# EasyEDA Pro project 51单片机串口开关V3.eprj

# Schematic Schematic1
Create Date: 2023-08-01; Page Name: P1; Project Name: 51单片机串口开关V3; Schematic Name: Schematic1; Update Date: 2023-11-15; Company: 嘉立创EDA; Page Size: A4; Version: V1.0
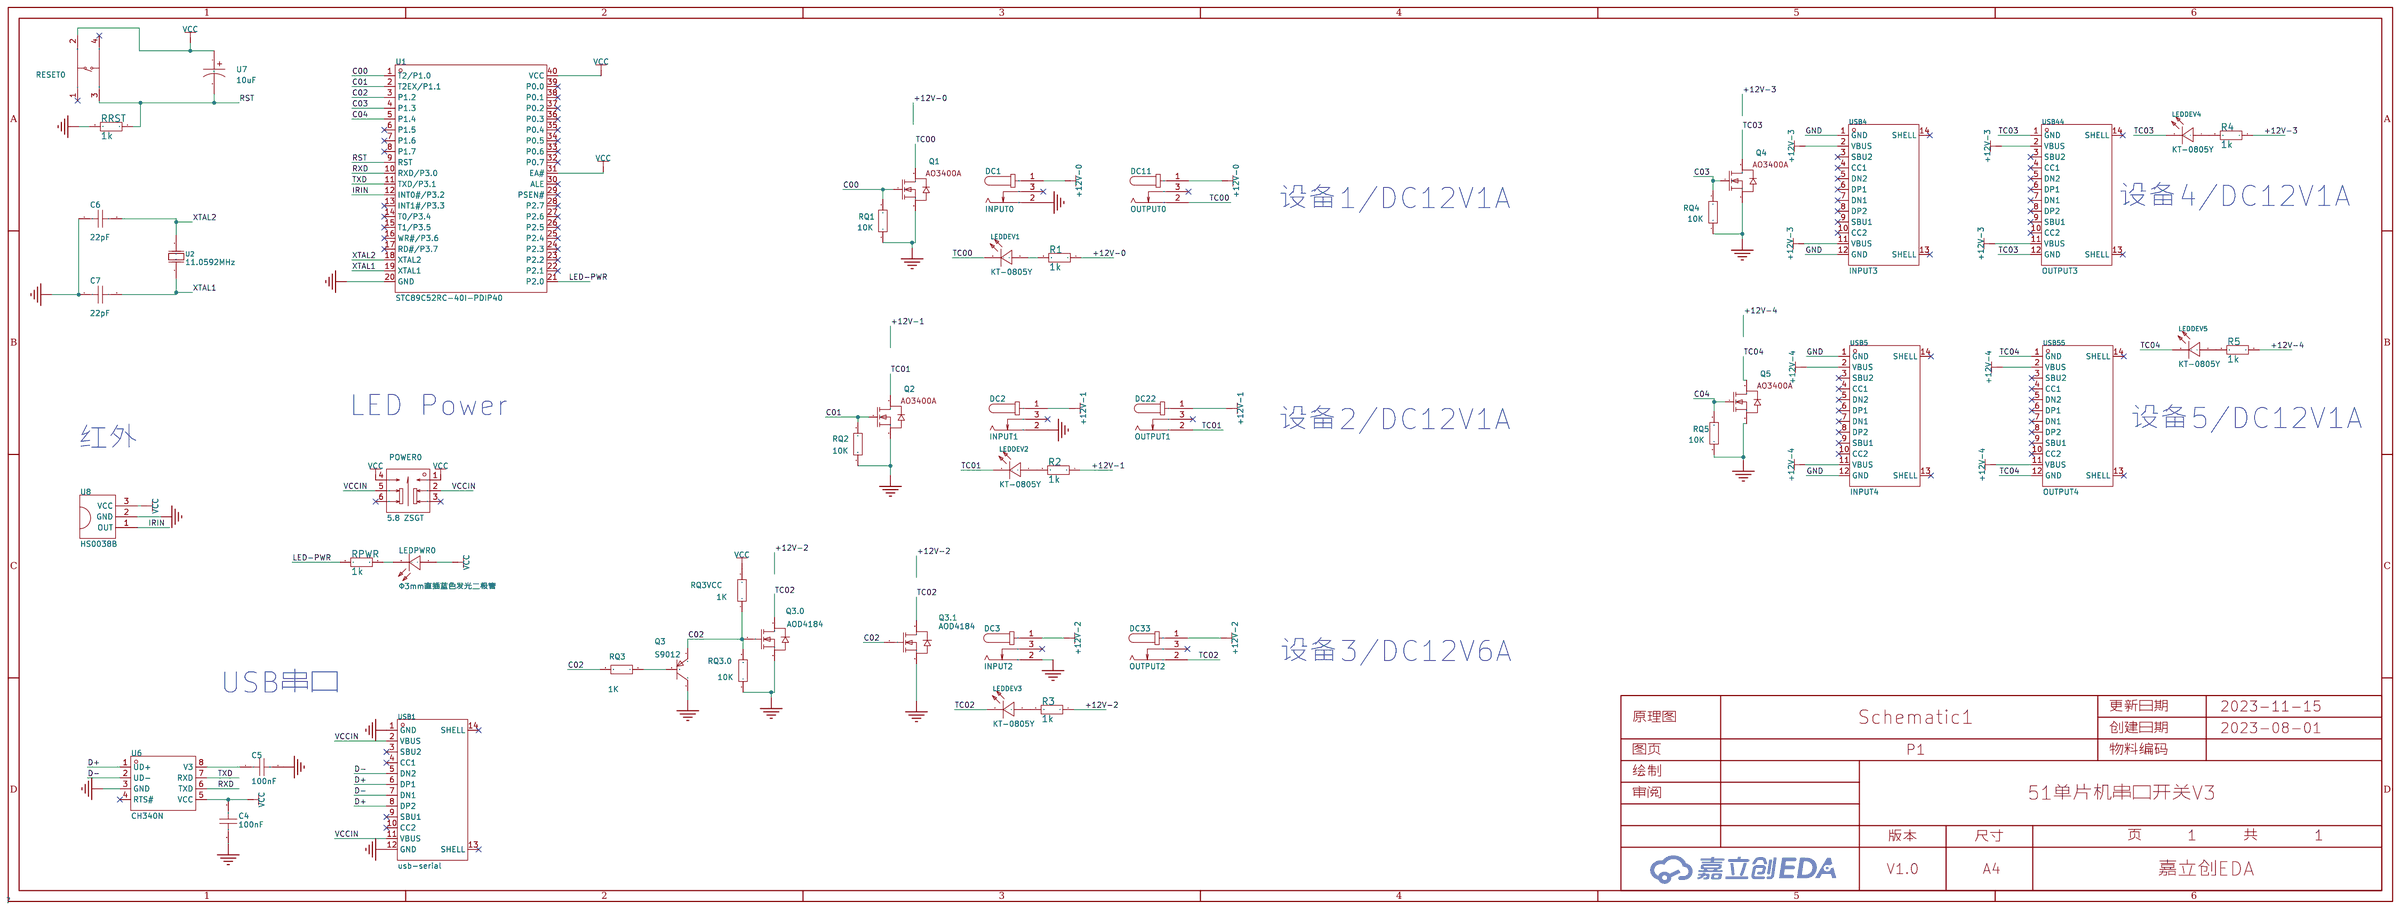
[diagram p0: schematic sheet]

## Parts
C4  100nF  [C0603]
C5  100nF  [C0603]
C6  22pF  [CAP-TH_L5.8-W2.4-P2.54-D0.6]
C7  22pF  [CAP-TH_L5.8-W2.4-P2.54-D0.6]
DC1  INPUT0  [DC-IN-TH_DC-005-20A]
DC2  INPUT1  [DC-IN-TH_DC-005-20A]
DC3  INPUT2  [DC-IN-TH_DC-005-20A]
DC11  OUTPUT0  [DC-IN-TH_DC-005-20A]
DC22  OUTPUT1  [DC-IN-TH_DC-005-20A]
DC33  OUTPUT2  [DC-IN-TH_DC-005-20A]
LEDDEV1  KT-0805Y  [LED0805-R-RD]
LEDDEV2  KT-0805Y  [LED0805-R-RD]
LEDDEV3  KT-0805Y  [LED0805-R-RD]
LEDDEV4  KT-0805Y  [LED0805-R-RD]
LEDDEV5  KT-0805Y  [LED0805-R-RD]
LEDPWR0  Φ3mm直插蓝色发光二极管  [LED-TH_BD4.1-P2.50-D0.5-FD_BULE]
POWER0  5.8 ZSGT  [SW-TH_5.8ZSGT]
Q1  AO3400A  [SOT-23-3_L2.9-W1.3-P1.90-LS2.4-BR]
Q2  AO3400A  [SOT-23-3_L2.9-W1.3-P1.90-LS2.4-BR]
Q3  S9012  [TO-92-3_L4.6-W3.6-P1.27-L-1]
Q3.0  AOD4184  [TO-252-2_L6.6-W6.1-P4.58-LS9.9-BR]
Q3.1  AOD4184  [TO-252-2_L6.6-W6.1-P4.58-LS9.9-BR]
Q4  AO3400A  [SOT-23-3_L2.9-W1.3-P1.90-LS2.4-BR]
Q5  AO3400A  [SOT-23-3_L2.9-W1.3-P1.90-LS2.4-BR]
R1  1k  [0603]
R2  1k  [0603]
R3  1k  [0603]
R4  1k  [0603]
R5  1k  [0603]
RESET0  TS665CJ  [SW-TH_4P-L6.0-W6.0-P4.50-LS6.5]
RPWR  1k  [0603]
RQ1  10K  [R0603]
RQ2  10K  [R0603]
RQ3  1K  [R0603]
RQ3.0  10K  [R0603]
RQ3VCC  1K  [R0603]
RQ4  10K  [R0603]
RQ5  10K  [R0603]
RRST  1k  [0603]
U1  STC89C52RC-40I-PDIP40  [DIP-40_L52.0-W13.7-P2.54-LS15.2-BL]
U2  11.0592MHz  [CRYSTAL-TH_L10.8-W4.5-P4.88]
U6  CH340N  [SOP-8_L4.9-W3.9-P1.27-LS6.0-BL]
U7  10uF  [CAP-TH_BD6.3-P2.50-D0.5-FD]
U8  HS0038B  [OPTO-TH_HS0038B-A]
USB1  usb-serial  [USB-C-SMD_TYPE-C-6PIN-2MD-073]
USB4  INPUT3  [USB-C-SMD_TYPE-C-6PIN-2MD-073]
USB5  INPUT4  [USB-C-SMD_TYPE-C-6PIN-2MD-073]
USB44  OUTPUT3  [USB-C-SMD_TYPE-C-6PIN-2MD-073]
USB55  OUTPUT4  [USB-C-SMD_TYPE-C-6PIN-2MD-073]

## Library data of the parts
C4 C5 = CAP_0603: Supplier Footprint: 0603
C6 C7 = CC1H220KA1EDCH4B1100: 容值:22pF;精度:±10%;额定电压:50V;温度系数:NP0;; LCSC Part Name: 22pF ±10% 50V; Supplier Part: C2832510; Manufacturer: Dersonic(德尔创); Supplier Footprint: 插件,P=2.54mm; JLCPCB Part Class: 扩展库; Datasheet: https://atta.szlcsc.com/upload/public/pdf/source/20211103/062C09467AB58979163D97626BAD0297.pdf; Supplier: LCSC; Tolerance: ±10%; Voltage Rated: 50V; Lead Spacing: 2.54mm; Temperature Coefficient: NP0; φD: 4.8mm; Body Thickness: 2.4mm
DC1-DC3 DC11 DC22 DC33 = DC-005-20A_C136744: 触点内径:2mm;触点外径:6.4mm;额定电流:500mA;额定电压:30V;; LCSC Part Name: DC-005-20A  内芯2.0mm 全铜; Supplier Part: C136744; Manufacturer: 韩国韩荣; Manufacturer Part: DC-005-20A; Supplier Footprint: 插件; JLCPCB Part Class: 扩展库; Datasheet: https://atta.szlcsc.com/upload/public/pdf/source/20210810/D1FE451D887B1804F0660F580C4AD849.pdf; Supplier: LCSC; Inside Contact Diameter: 2mm; Outside Contact Diameter: 6.4mm; Current Rating (Max): 500mA; Voltage Rating (Max): 30V
LEDDEV1-LEDDEV5 = KT-0805Y: 发光颜色:黄灯;二极管配置:-;透镜颜色:-;主波长:-;色温:-;功率:-;发光角度:-;安装方式:-;工作温度:-;; LCSC Part Name: 0805 黄灯 高亮; Supplier Part: C2296; Manufacturer: KENTO; Supplier Footprint: 0805; JLCPCB Part Class: 基础库; Datasheet: https://atta.szlcsc.com/upload/public/pdf/source/20160421/1461205044170.pdf; Supplier: LCSC; Emitted Color: 黄灯
LEDPWR0 = Φ3mm直插蓝色发光二极管: Supplier Part: C9900011188; Supplier Footprint: LED-TH; JLCPCB Part Class: 扩展库; Datasheet: https://atta.szlcsc.comnull; Supplier: LCSC
POWER0 = 5.8 ZSGT: 触点电流:110mA;额定电压 (DC):30V;绝缘电阻:100MΩ;电路结构:双刀双掷;安装方式:直插;自锁/无锁:自锁;按键形状:方形按钮;按键/盖帽颜色:白色;带灯:无;引脚样式:PC引脚;作用力:150gf@±50gf;工作温度:-10℃~+70℃;机械寿命:100000;; LCSC Part Name: 5.8*5.8有头/高头 带锁/自锁开关 泡泡机开关; Supplier Part: C2681587; Manufacturer: SHOU HAN(首韩); Supplier Footprint: 插件; Datasheet: https://atta.szlcsc.com/upload/public/pdf/source/20210107/C2681587_CDDDDA4A1C7AC9FEB01815B75893A6BA.pdf; Supplier: LCSC; Contact Current: 110mA; Voltage Rating (DC): 30V; Insulation Resistance: 100MΩ; Circuit: 双刀双掷; Mounting Style: 直插; Self Lock / No Lock: 自锁; Actuator Style: 方形按钮; Actuator/Cap Color: 白色; With Lamp: 无; Pin Style: PC引脚; Operating Force: 150gf@±50gf; Operating Temperature: -10℃~+70℃; Mechanical Life: 100000
Q1 Q2 Q4 Q5 = AO3400A_C347475: 类型:N沟道;漏源电压(Vdss):30V;连续漏极电流(Id):5.8A;功率(Pd):1.4W;导通电阻(RDS(on)@Vgs,Id):35mΩ@10V,5.8A;; LCSC Part Name: N沟道 30V 5.8A; Supplier Part: C347475; Manufacturer: UMW(广东友台半导体); Supplier Footprint: SOT-23; JLCPCB Part Class: 扩展库; Datasheet: https://atta.szlcsc.com/upload/public/pdf/source/20220429/98B7D6B2B83615ED4523A0C76368EB06.pdf; Supplier: LCSC; Type: N沟道; Drain Source Voltage (Vdss): 30V; Continuous Drain Current (Id): 5.8A; Power Dissipation (Pd): 1.4W; Drain Source On Resistance (RDS(on)@Vgs,Id): 35mΩ@10V,5.8A; Gate Threshold Voltage (Vgs(th)@Id): 1.4V@250uA; Total Gate Charge (Qg@Vgs): 12nC@4.5V; Input Capacitance (Ciss@Vds): 1.05nF@15V; Operating Temperature: -55℃~+150℃@(Tj)
Q3 = S9012_C2931496: Supplier Part: C2931496; Manufacturer: JSMSEMI(杰盛微); Supplier Footprint: TO-92-3; JLCPCB Part Class: 扩展库; Datasheet: https://atta.szlcsc.com/upload/public/pdf/source/20211216/8B1045EB70E9342E1C247EF466AD93DE.pdf; Supplier: LCSC
Q3.0 Q3.1 = AOD4184: 类型:N沟道;漏源电压(Vdss):40V;连续漏极电流(Id):85A;功率(Pd):-;导通电阻(RDS(on)@Vgs,Id):5mΩ@10V,85A;阈值电压(Vgs(th)@Id):-;栅极电荷(Qg@Vgs):-;输入电容(Ciss@Vds):-;反向传输电容(Crss@Vds):-;; LCSC Part Name: N沟道 40V 85A; Supplier Part: C879026; Manufacturer: VBsemi(微碧); Supplier Footprint: TO-252; JLCPCB Part Class: 扩展库; Datasheet: https://atta.szlcsc.com/upload/public/pdf/source/20200930/C879026_1C5ED3CC2E280C7EDEB6515D52B7B7F3.pdf; Supplier: LCSC; Type: N沟道; Drain Source Voltage (Vdss): 40V; Continuous Drain Current (Id): 85A; Drain Source On Resistance (RDS(on)@Vgs,Id): 5mΩ@10V,85A
R1-R5 RPWR RRST = 1k: Resistor; Origin Footprint 2: RES-0805; Origin Footprint 4: RES-1206; Origin Footprint 5: RES-1210; Origin Footprint 6: RES-1812; Origin Footprint 7: RES-2512; Origin Footprint 8: RES-0.25W-6.5X2.5-10.16-0.6; Origin Footprint 9: RES-0.5W-10.0X3.5-12.7-1; Origin Footprint 10: RES-1W-12.0X5.0-15.24-1; Origin Footprint 11: RES-2W-16.0X5.5-20.32-1; Origin Footprint 12: RES-3W-17.0X6.5-22.86-1; Origin Footprint 13: RES-5W-22.0X10.0-30.48-1; Design Item ID: RES; Library Name: General
RESET0 = TS665CJ: 触点电流:50mA;额定电压(DC):12V;电路结构:单刀单掷;安装方式:直插;带灯:-;机械寿命:-;; LCSC Part Name: 6*6*5mm 直插 轻触开关; Supplier Part: C393938; Manufacturer: SHOU HAN(首韩); Supplier Footprint: 插件; JLCPCB Part Class: 扩展库; Datasheet: https://atta.szlcsc.com/upload/public/pdf/source/20190521/C393938_BDABEAC600B4C55E200A80AA129B70BC.pdf; Supplier: LCSC; Contact Current: 50mA; Voltage Rating (DC): 12V; Circuit: 单刀单掷; Mounting Style: 直插; Actuator Style: 圆形按钮; Switch Length: 6mm; Switch Width: 6mm; Switch Height: 5mm
RQ1-RQ3 RQ3.0 RQ3VCC RQ4 RQ5 = Res_0603: Supplier Footprint: 0603
U1 = STC89C52RC-40I-PDIP40: CPU内核:51系列;CPU最大主频:-;工作电压范围:3.3V~5.5V;内部振荡器:-;外部时钟频率范围:-;程序 FLASH容量:8KB;RAM总容量:512Byte;EEPROM/数据 FLASH容量:4KB;GPIO端口数量:35;ADC(单元数/通道数/位数):-;DAC(单元数/通道数/位数):-;(E)PWM(单元数/通道数/位数):-;8位Timer数量:-;16位Timer数量:3;32位Timer数量:-;内部比较器数量:-;U(S)ART路数:1;I2C路数:-;I2S路数:-;(; LCSC Part Name: 51系列 闪存：8KB RAM：512Byte; Supplier Part: C14022; Manufacturer: STC(宏晶); Supplier Footprint: DIP-40; JLCPCB Part Class: 扩展库; Datasheet: https://atta.szlcsc.com/upload/public/pdf/source/20210104/C14022_3E6032FDBB5DBC6F971AD019A8472F5B.pdf; Supplier: LCSC; CPU Core: 51系列; Supply Voltage Range: 3.3V~5.5V; Program FLASH Size: 8KB; RAM Size: 512Byte; EEPROM/Data FLASH Size: 4KB; GPIO Ports Number: 35; 16Bit Timer Number: 3; U(S)ART Number: 1; Peripherals / Functions / Protocol Stacks: 看门狗; Operating Temperature Range: -40℃~+85℃
U2 = ATS100B-E: 频率:10MHz;频率公差:±30ppm;负载电容:18pF;; LCSC Part Name: 10MHz ±30ppm 18pF; Supplier Part: C1669693; Manufacturer: CTS(西迪斯); Supplier Footprint: HC-49S; JLCPCB Part Class: 扩展库; Datasheet: https://atta.szlcsc.com/upload/public/pdf/source/20220124/B9986DAB42ECDE31CA8A9C6A4A6F535C.pdf; Supplier: LCSC; Frequency Tolerance: ±30ppm; Frequency Stability: ±50ppm; Load Capacitance: 18pF; Equivalent Series Resistance (ESR): 60Ω; Operating Temperature: -40℃~+85℃
U6 = CH340N: LCSC Part Name: USB转串口芯片 CH340; Supplier Part: C2977777; Manufacturer: WCH(南京沁恒); Supplier Footprint: SOP-8; Datasheet: https://atta.szlcsc.com/upload/public/pdf/source/20220223/82A45E4FF89B3EDCAD50B354450A7EF4.pdf; Supplier: LCSC
U7 = ESK106M1HD11RRSNP-R: 容值:10uF;精度:±20%;额定电压:50V;纹波电流:-;等效串联电阻:-;; LCSC Part Name: 10uF ±20% 50V; Supplier Part: C3015490; Manufacturer: MAN YUE(万裕科技); Supplier Footprint: 插件; JLCPCB Part Class: 扩展库; Datasheet: https://atta.szlcsc.com/upload/public/pdf/source/20190724/C406799_CDF11B2185D3B9C175922EABD678815E.pdf; Supplier: LCSC; Tolerance: ±20%; Rated Voltage: 50V; φD: 5mm; L: 11mm
U8 = HS0038B: Supplier Part: C9900001501; Supplier Footprint: DIP-3; JLCPCB Part Class: 扩展库; Datasheet: 2021-11-06/848019G/9d0c8d3ebb7f4498b21a2c16cf887121/HS0038B.pdf; Supplier: LCSC
USB1 USB4 USB5 USB44 USB55 = TYPE-C 16PIN 2MD(073): 连接器类型:Type-C;标准:-;公母:母座;触点数量:16;端口数量:1;安装方式:卧贴;额定电流 - 电源:5A;工作温度范围:-25℃~+85℃;; LCSC Part Name: TYPE-C母座 16P 4脚插件带定位柱 不锈钢外壳 2次模顶; Supplier Part: C2765186; Manufacturer: SHOU HAN(首韩); Supplier Footprint: SMD; Supplier: LCSC; Connector Type: Type-C; Gender: 母座; Number of Contacts: 16; Number of Ports: 1; Mounting Style: 卧贴; Current Rating - Power (Max): 5A; Operating Temperature Range: -25℃~+85℃

## Nets
+12V-0: DC1.1 DC11.1 R1.1
+12V-1: DC2.1 DC22.1 R2.1
+12V-2: DC3.1 DC33.1 R3.1
+12V-3: R4.1 USB4.2(VBUS) USB4.11(VBUS) USB44.2(VBUS) USB44.11(VBUS)
+12V-4: R5.1 USB5.2(VBUS) USB5.11(VBUS) USB55.2(VBUS) USB55.11(VBUS)
GND: C4.2 C5.2 C6.1 C7.1 DC1.2 DC2.2 DC3.2 Q1.2(S) Q2.2(S) Q3.3(C) Q3.0.3(S) Q3.1.3(S) Q4.2(S) Q5.2(S) RQ1.1 RQ2.1 RQ3.0.1 RQ4.1 RQ5.1 RRST.2 U1.20(GND) U6.3(GND) U8.2(GND) USB1.1(GND) USB1.12(GND) USB4.1(GND) USB4.12(GND) USB5.1(GND) USB5.12(GND)
VCC: C4.1 LEDPWR0.1(+) POWER0.1 POWER0.4 RESET0.2(B) RQ3VCC.2 U1.31(EA#) U1.40(VCC) U6.5(VCC) U7.1 U8.3(VCC)
VCCIN: POWER0.2 POWER0.5 USB1.2(VBUS) USB1.11(VBUS)
C00: Q1.1(G) RQ1.2 U1.1(T2/P1.0)
C01: Q2.1(G) RQ2.2 U1.2(T2EX/P1.1)
C02: Q3.1(E) Q3.0.1(G) Q3.1.1(G) RQ3.2 RQ3.0.2 RQ3VCC.1 U1.3(P1.2)
C03: Q4.1(G) RQ4.2 U1.4(P1.3)
C04: Q5.1(G) RQ5.2 U1.5(P1.4)
D+: U6.1(UD+) USB1.6(DP1) USB1.8(DP2)
D-: U6.2(UD-) USB1.5(DN2) USB1.7(DN1)
IRIN: U1.12(INT0#/P3.2) U8.1(OUT)
LED-PWR: RPWR.2 U1.21(P2.0)
RST: RESET0.3(C) RRST.1 U1.9(RST) U7.2
RXD: U1.10(RXD/P3.0) U6.6(TXD)
TC00: DC11.2 LEDDEV1.2(-) Q1.3(D)
TC01: DC22.2 LEDDEV2.2(-) Q2.3(D)
TC02: DC33.2 LEDDEV3.2(-) Q3.0.2(D) Q3.1.2(D)
TC03: LEDDEV4.2(-) Q4.3(D) USB44.1(GND) USB44.12(GND)
TC04: LEDDEV5.2(-) Q5.3(D) USB55.1(GND) USB55.12(GND)
TXD: U1.11(TXD/P3.1) U6.7(RXD)
XTAL1: C7.2 U1.19(XTAL1) U2.2
XTAL2: C6.2 U1.18(XTAL2) U2.1
$1N2137: C5.1 U6.8(V3)
$1N11558: LEDPWR0.2(-) RPWR.1
$1N11682: LEDDEV1.1(+) R1.2
$1N30605: Q3.2(B) RQ3.1
$1N32454: LEDDEV2.1(+) R2.2
$1N32490: LEDDEV3.1(+) R3.2
$1N32526: LEDDEV4.1(+) R4.2
$1N32562: LEDDEV5.1(+) R5.2

Not connected (* = marked no-connect by the designer): DC1 3*; DC2 3*; DC3 3*; DC11 3*; DC22 3*; DC33 3*; POWER0 3* 6*; RESET0 1(A)* 4(D)*; U1 6(P1.5)* 7(P1.6)* 8(P1.7)* 13(INT1#/P3.3)* 14(T0/P3.4)* 15(T1/P3.5)* 16(WR#/P3.6)* 17(RD#/P3.7)* 22(P2.1)* 23(P2.2)* 24(P2.3)* 25(P2.4)* 26(P2.5)* 27(P2.6)* 28(P2.7)* 29(PSEN#)* 30(ALE)* 32(P0.7)* 33(P0.6)* 34(P0.5)* 35(P0.4)* 36(P0.3)* 37(P0.2)* 38(P0.1)* 39(P0.0)*; U6 4(RTS#)*; USB1 3(SBU2)* 4(CC1)* 9(SBU1)* 10(CC2)* 13(SHELL)* 14(SHELL)*; USB4 3(SBU2)* 4(CC1)* 5(DN2)* 6(DP1)* 7(DN1)* 8(DP2)* 9(SBU1)* 10(CC2)* 13(SHELL)* 14(SHELL)*; USB5 3(SBU2)* 4(CC1)* 5(DN2)* 6(DP1)* 7(DN1)* 8(DP2)* 9(SBU1)* 10(CC2)* 13(SHELL)* 14(SHELL)*; USB44 3(SBU2)* 4(CC1)* 5(DN2)* 6(DP1)* 7(DN1)* 8(DP2)* 9(SBU1)* 10(CC2)* 13(SHELL)* 14(SHELL)*; USB55 3(SBU2)* 4(CC1)* 5(DN2)* 6(DP1)* 7(DN1)* 8(DP2)* 9(SBU1)* 10(CC2)* 13(SHELL)* 14(SHELL)*

## Notes on the sheet
- 设备1/DC12V1A
- 设备4/DC12V1A
- LED Power
- 设备2/DC12V1A
- 设备5/DC12V1A
- 红外
- 设备3/DC12V6A
- USB串口

# Board PCB1
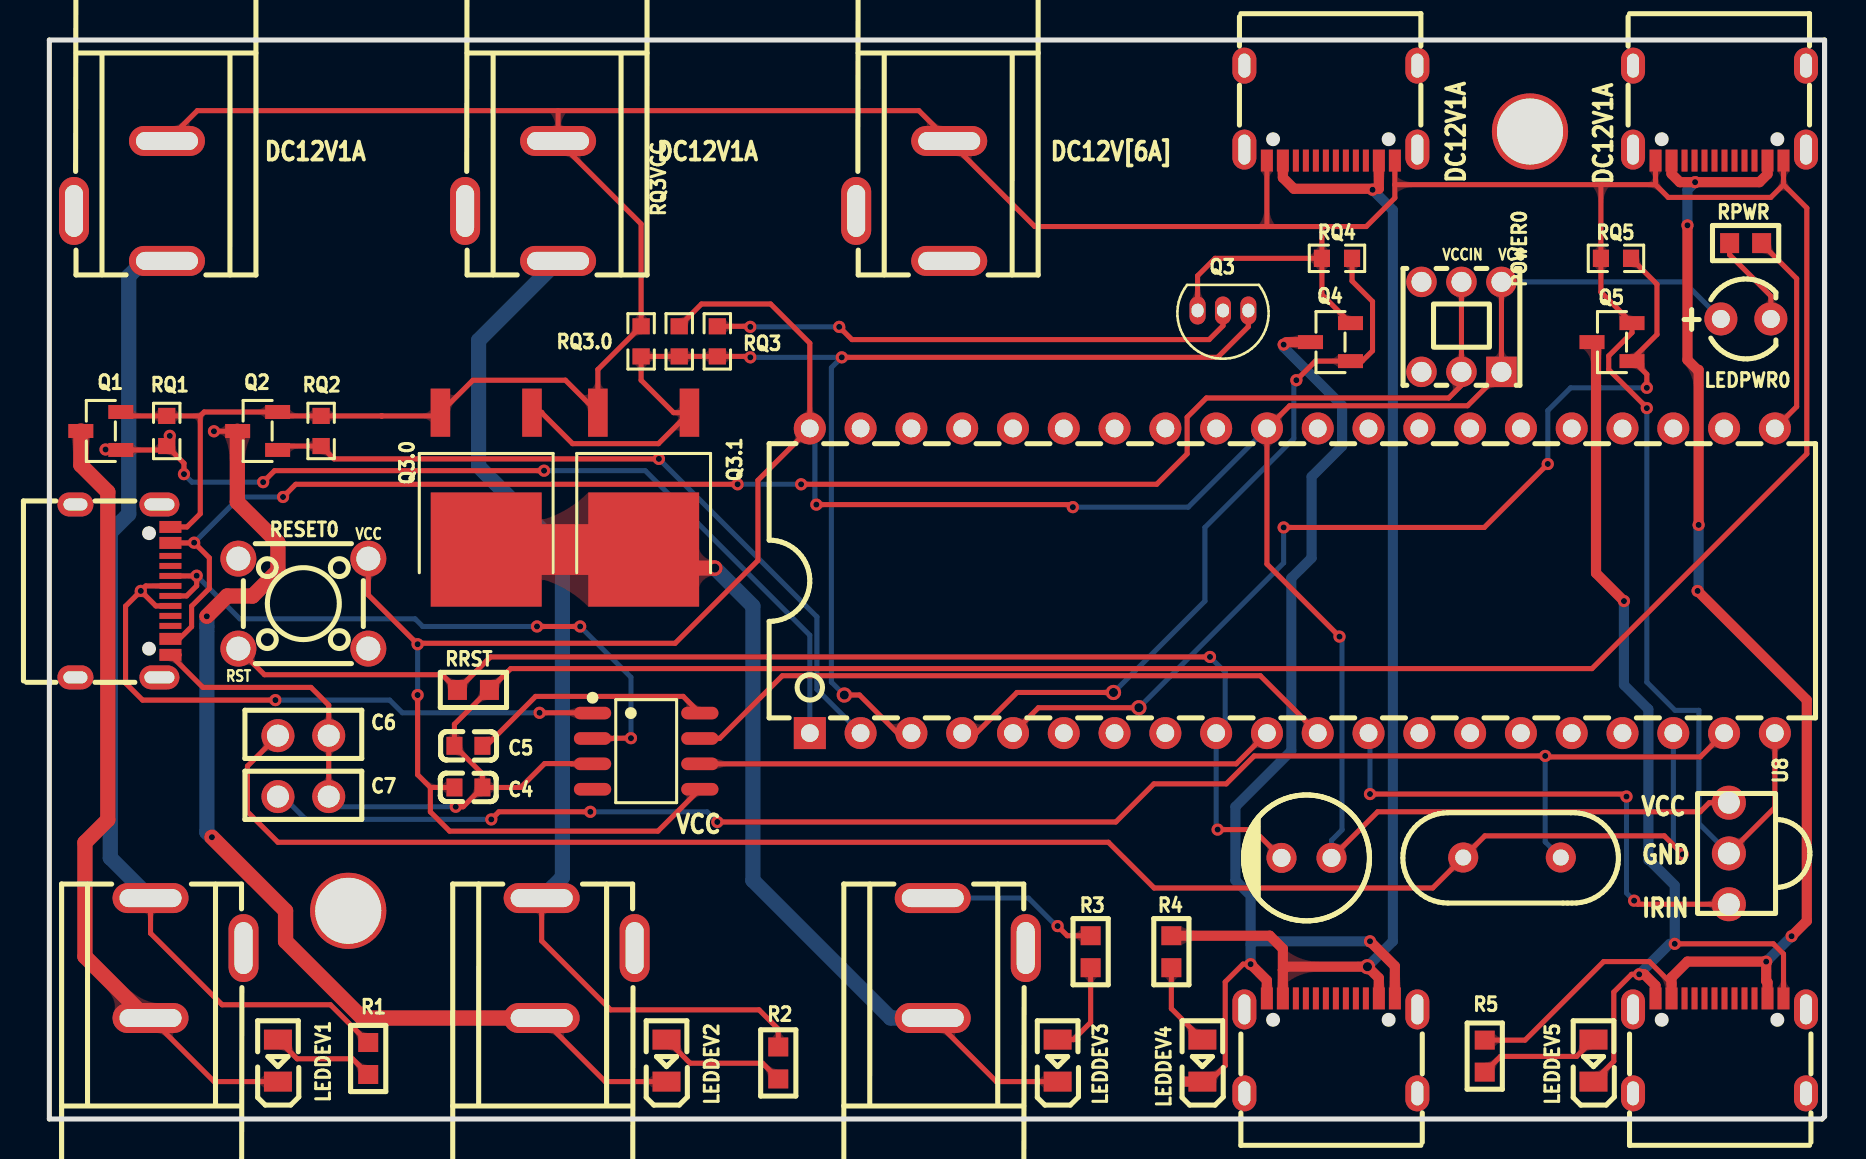
[diagram p1: board, top side]
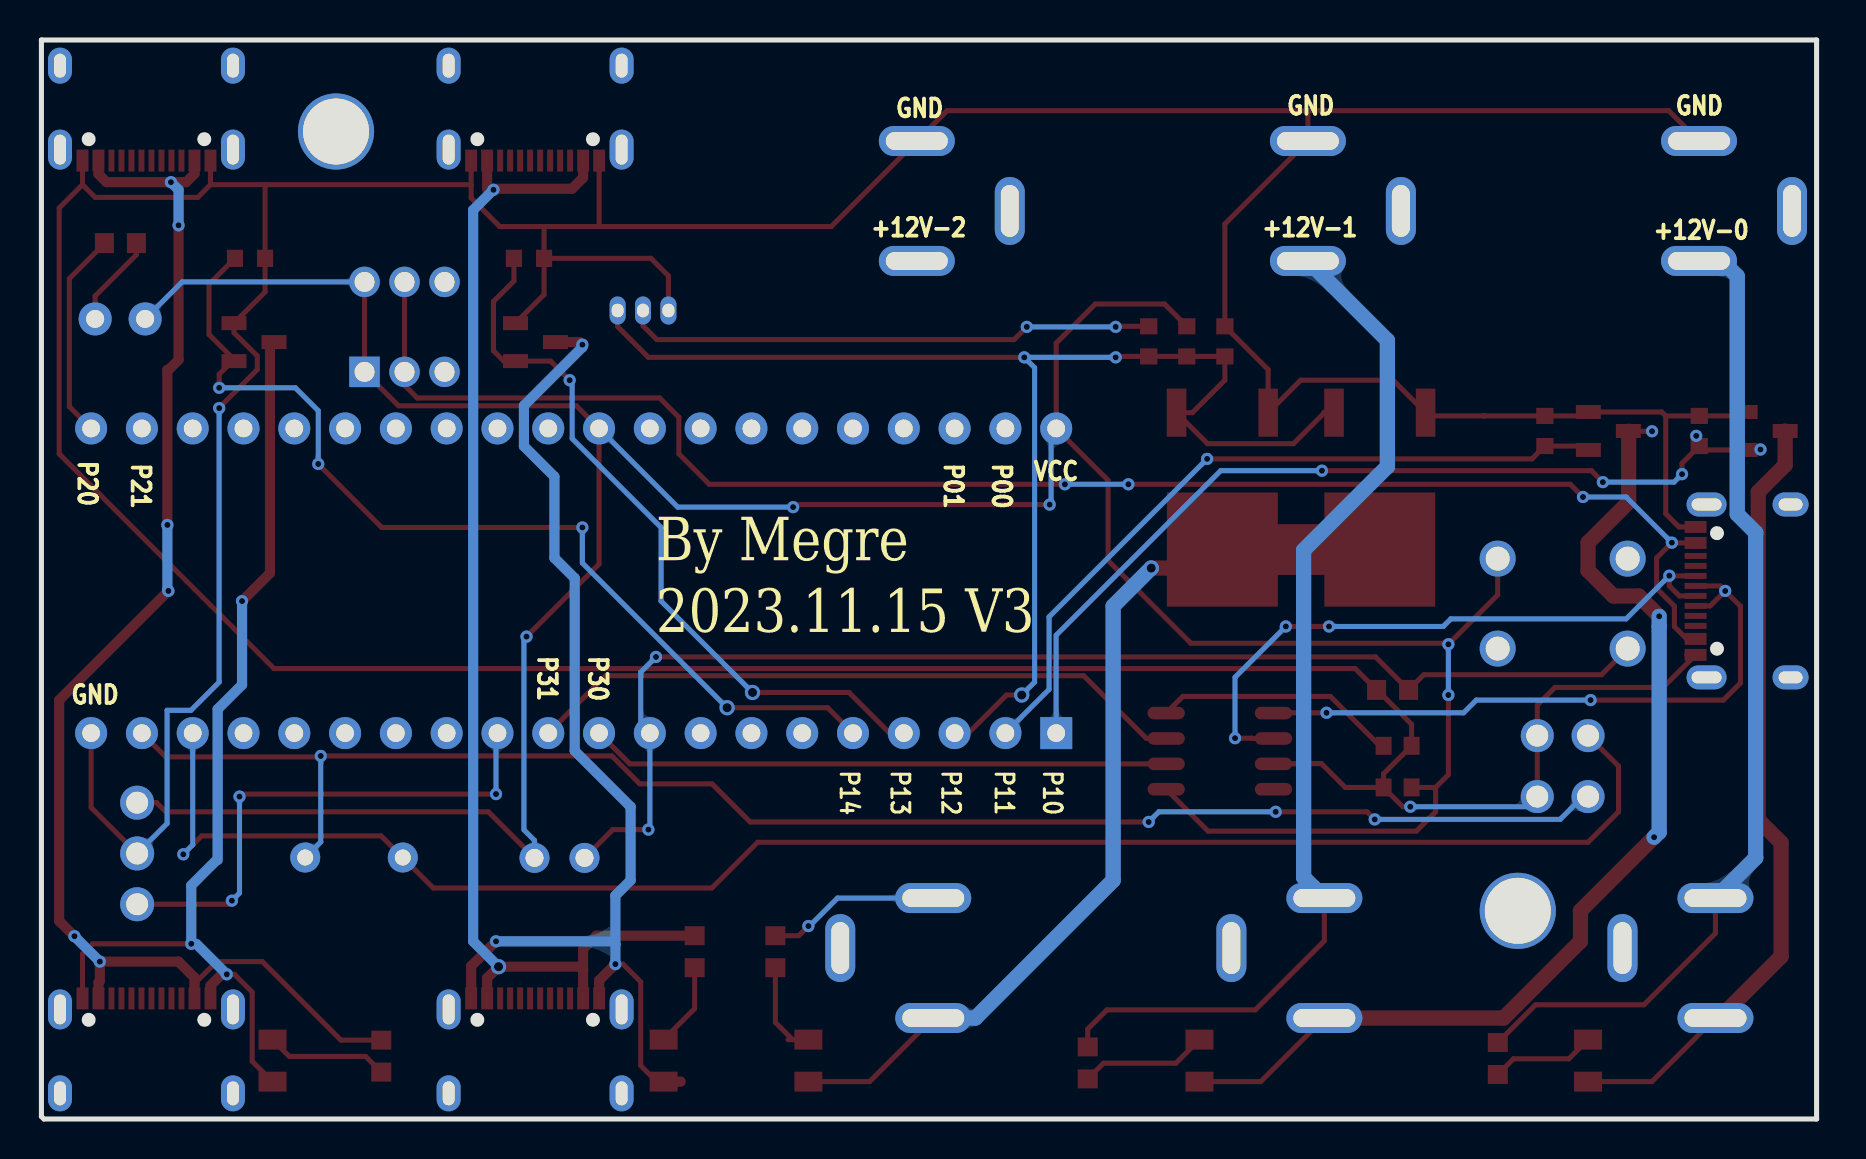
[diagram p2: board, bottom side, seen from below]

Outline 88.77 x 53.98 mm; copper layers: Top Layer, Bottom Layer. Coordinates in mm from the lower left corner of the outline.
Outline path: 0,53.98 88.77,53.98 88.77,0.13 88.65,0 0,0 0,53.98
Stack: Top Layer 0.035mm / Dielectric1 1.51mm FR4 er 4.5 / Bottom Layer 0.035mm

## Design rules (mm)
template: JLCPCB Capability(Two Layers Board)
spacing copperThickness1oz (default): track to track 0.102, other pairs 0.152 to 0.3
spacing copperThickness2oz: track to track 0.203, other pairs 0.152 to 0.3
track width copperThickness1oz (default): min 0.127, default 0.254, max 2.54
track width copperThickness2oz: min 0.203, default 0.254, max 2.54
differential pair differentialPair (default): width min 0.127, default 0.254, max 2.54; gap min 0.152, default 0.152
via viaSize (default): diameter min 0.5, default 0.61, max 10; hole min 0.3, default 0.305, max 6.3

## Placement (name value [footprint] x y rotation side)
C4  100nF  [C0603]  20.95 16.59 0 top
C5  100nF  [C0603]  20.95 18.67 180 top
C6  22pF  [CAP-TH_L5.8-W2.4-P2.54-D0.6]  12.7 19.18 180 top
C7  22pF  [CAP-TH_L5.8-W2.4-P2.54-D0.6]  12.7 16.13 180 top
DC1  INPUT0  [DC-IN-TH_DC-005-20A]  3.56 45.92 270 top
DC2  INPUT1  [DC-IN-TH_DC-005-20A]  23.11 45.92 270 top
DC3  INPUT2  [DC-IN-TH_DC-005-20A]  42.67 45.92 270 top
DC11  OUTPUT0  [DC-IN-TH_DC-005-20A]  7.38 8.05 90 top
DC22  OUTPUT1  [DC-IN-TH_DC-005-20A]  26.94 8.05 90 top
DC33  OUTPUT2  [DC-IN-TH_DC-005-20A]  46.5 8.05 90 top
LEDDEV1  KT-0805Y  [LED0805-R-RD]  11.43 2.92 90 top
LEDDEV2  KT-0805Y  [LED0805-R-RD]  30.86 2.92 90 top
LEDDEV3  KT-0805Y  [LED0805-R-RD]  50.42 2.92 90 top
LEDDEV4  KT-0805Y  [LED0805-R-RD]  57.66 2.92 90 top
LEDDEV5  KT-0805Y  [LED0805-R-RD]  77.22 2.92 90 top
LEDPWR0  Φ3mm直插蓝色发光二极管  [LED-TH_BD4.1-P2.50-D0.5-FD_BULE]  84.84 40.02 0 top
NOREF  -  [Pad_e17230]  74.04 49.4 0 top
NOREF#2  -  [Pad_e17232]  14.94 10.41 0 top
POWER0  5.8 ZSGT  [SW-TH_5.8ZSGT]  70.61 39.62 0 top
Q1  AO3400A  [SOT-23-3_L2.9-W1.3-P1.90-LS2.4-BR]  2.57 34.42 0 top
Q2  AO3400A  [SOT-23-3_L2.9-W1.3-P1.90-LS2.4-BR]  10.41 34.42 0 top
Q3  S9012  [TO-92-3_L4.6-W3.6-P1.27-L-1]  58.69 40.44 180 top
Q3.0  AOD4184  [TO-252-2_L6.6-W6.1-P4.58-LS9.9-BR]  21.84 31.91 90 top
Q3.1  AOD4184  [TO-252-2_L6.6-W6.1-P4.58-LS9.9-BR]  29.72 31.91 90 top
Q4  AO3400A  [SOT-23-3_L2.9-W1.3-P1.90-LS2.4-BR]  64.07 38.86 0 top
Q5  AO3400A  [SOT-23-3_L2.9-W1.3-P1.90-LS2.4-BR]  78.14 38.86 0 top
R1  1k  [0603]  15.94 3.03 270 top
R2  1k  [0603]  36.45 2.81 270 top
R3  1k  [0603]  52.07 8.37 270 top
R4  1k  [0603]  56.11 8.37 270 top
R5  1k  [0603]  71.78 3.15 270 top
RESET0  TS665CJ  [SW-TH_4P-L6.0-W6.0-P4.50-LS6.5]  12.7 25.78 0 top
RPWR  1k  [0603]  84.82 43.81 0 top
RQ1  10K  [R0603]  5.87 34.42 270 top
RQ2  10K  [R0603]  13.59 34.42 270 top
RQ3  1K  [R0603]  33.4 38.9 270 top
RQ3.0  10K  [R0603]  29.59 38.9 270 top
RQ3VCC  1K  [R0603]  31.5 38.9 90 top
RQ4  10K  [R0603]  64.39 43.05 0 top
RQ5  10K  [R0603]  78.34 43.05 0 top
RRST  1k  [0603]  21.21 21.46 0 top
U1  STC89C52RC-40I-PDIP40  [DIP-40_L52.0-W13.7-P2.54-LS15.2-BL]  62.16 26.92 0 top
U2  11.0592MHz  [CRYSTAL-TH_L10.8-W4.5-P4.88]  73.14 13.08 0 top
U6  CH340N  [SOP-8_L4.9-W3.9-P1.27-LS6.0-BL]  29.85 18.4 270 top
U7  10uF  [CAP-TH_BD6.3-P2.50-D0.5-FD]  62.86 13.06 180 top
U8  HS0038B  [OPTO-TH_HS0038B-A]  83.99 13.28 270 top
USB1  usb-serial  [USB-C-SMD_TYPE-C-6PIN-2MD-073]  3.68 26.42 270 top
USB4  INPUT3  [USB-C-SMD_TYPE-C-6PIN-2MD-073]  64.08 50.32 180 top
USB5  INPUT4  [USB-C-SMD_TYPE-C-6PIN-2MD-073]  83.52 50.32 180 top
USB44  OUTPUT3  [USB-C-SMD_TYPE-C-6PIN-2MD-073]  64.08 3.66 0 top
USB55  OUTPUT4  [USB-C-SMD_TYPE-C-6PIN-2MD-073]  83.52 3.66 0 top

## Footprints (pads in the part's own frame, mm; a bottom-side part is the same pattern mirrored in y, then rotated)
0603
  rect 0.95x1 smd: 1(-0.8,0) 2(0.8,0)
C0603
  rect 0.8x0.9 smd: 1(-0.7,0) 2(0.7,0)
CAP-TH_BD6.3-P2.50-D0.5-FD
  round 1.5 hole 0.9: 1(-1.25,0) 2(1.25,0)
CAP-TH_L5.8-W2.4-P2.54-D0.6
  round 1.65 hole 1.1: 1(-1.27,0) 2(1.27,0)
CRYSTAL-TH_L10.8-W4.5-P4.88
  round 1.5 hole 0.8: 1(-2.44,0) 2(2.44,0)
DC-IN-TH_DC-005-20A
  oval 1.5x3.8 hole 0.9x3.1: 1(3,2.325) 2(-3,2.325)
  oval 3.4x1.5 hole 2.6x0.9: 3(0.5,-2.325)
DIP-40_L52.0-W13.7-P2.54-LS15.2-BL
  rect 1.6x1.6 hole 0.889: 1(-24.13,-7.62)
  round 1.6 hole 0.889: 2(-21.59,-7.62) 3(-19.05,-7.62) 4(-16.51,-7.62) 5(-13.97,-7.62) 6(-11.43,-7.62) 7(-8.89,-7.62) 8(-6.35,-7.62) 9(-3.81,-7.62) 10(-1.27,-7.62) 11(1.27,-7.62) 12(3.81,-7.62) 13(6.35,-7.62) 14(8.89,-7.62) 15(11.43,-7.62) 16(13.97,-7.62) 17(16.51,-7.62) 18(19.05,-7.62) 19(21.59,-7.62) 20(24.13,-7.62) 21(24.13,7.62) 22(21.59,7.62) 23(19.05,7.62) 24(16.51,7.62) 25(13.97,7.62) 26(11.43,7.62) 27(8.89,7.62) 28(6.35,7.62) 29(3.81,7.62) 30(1.27,7.62) 31(-1.27,7.62) 32(-3.81,7.62) 33(-6.35,7.62) 34(-8.89,7.62) 35(-11.43,7.62) 36(-13.97,7.62) 37(-16.51,7.62) 38(-19.05,7.62) 39(-21.59,7.62) 40(-24.13,7.62)
LED0805-R-RD
  rect 1x1.399 smd: 1(1.05,0) 2(-1.05,0)
LED-TH_BD4.1-P2.50-D0.5-FD_BULE
  round 1.651 hole 0.9: 1(-1.25,0) 2(1.25,0)
OPTO-TH_HS0038B-A
  round 1.7 hole 1.1: 1(2.54,0) 2(0,0) 3(-2.54,0)
Pad_e17230
  round 3.81 hole 3.302: 41(0,0)
Pad_e17232
  round 3.81 hole 3.302: 41(0,0)
R0603
  rect 0.806x0.864 smd: 1(-0.753,0) 2(0.753,0)
SOP-8_L4.9-W3.9-P1.27-LS6.0-BL
  oval 0.63x1.865 smd: 1(-1.905,-2.683) 2(-0.635,-2.683) 3(0.635,-2.683) 4(1.905,-2.683) 5(1.905,2.683) 6(0.635,2.683) 7(-0.635,2.683) 8(-1.905,2.683)
SOT-23-3_L2.9-W1.3-P1.90-LS2.4-BR
  rect 1.25x0.7 smd: 1(1,-0.95) 2(1,0.95) 3(-1,0)
SW-TH_4P-L6.0-W6.0-P4.50-LS6.5
  round 1.8 hole 1.2: 1(-3.25,2.25) 2(3.25,2.25) 3(-3.25,-2.25) 4(3.25,-2.25)
SW-TH_5.8ZSGT
  rect 1.524x1.524 hole 1: 1(2,-2.25)
  round 1.524 hole 1: 2(0,-2.25) 3(-2,-2.25) 4(2,2.25) 5(0,2.25) 6(-2,2.25)
TO-92-3_L4.6-W3.6-P1.27-L-1
  oval 0.8x1.4 hole 0.6x0.682: 1(-1.27,0) 2(0,0) 3(1.27,0)
TO-252-2_L6.6-W6.1-P4.58-LS9.9-BR
  rect 2.409x0.979 smd: 1(3.424,-2.29) 3(3.424,2.29)
  rect 5.711x5.548 smd: 2(-3.424,0)
USB-C-SMD_TYPE-C-6PIN-2MD-073
  rect 0.6x1.1 smd: 1(-3.2,2.375) 2(-2.4,2.375) 11(2.4,2.375) 12(3.2,2.375)
  rect 0.3x1.1 smd: 3(-1.75,2.375) 4(-1.25,2.375) 5(-0.75,2.375) 6(-0.25,2.375) 7(0.25,2.375) 8(0.75,2.375) 9(1.25,2.375) 10(1.75,2.375)
  oval 1.2x2 hole 0.6x1.5: 13(-4.325,1.825) 14(4.325,1.825)
  oval 1.2x1.8 hole 0.6x1.2: 13(-4.325,-2.375) 14(4.325,-2.375)

## Nets
As in the schematic.

Pads without a net: DC1 3; DC2 3; DC3 3; DC11 3; DC22 3; DC33 3; NOREF 41; NOREF#2 41; POWER0 3 6; RESET0 1 4; U1 6 7 8 13 14 15 16 17 22 23 24 25 26 27 28 29 30 32 33 34 35 36 37 38 39; U6 4; USB1 3 4 9 10 13 14; USB4 3 4 5 6 7 8 9 10 13 14; USB5 3 4 5 6 7 8 9 10 13 14; USB44 3 4 5 6 7 8 9 10 13 14; USB55 3 4 5 6 7 8 9 10 13 14

## Via types
v1: diameter 0.61, hole 0.305, Top Layer to Bottom Layer, 59 vias
v2: diameter 0.762, hole 0.457, Top Layer to Bottom Layer, 5 vias

## Routing (per net, layer and track width the routed paths; a pad name or vN(x,y) marks a point on that pad's centre or on a via; arc(x,y) is an arc through that point)
+12V-0: length 49.5
  Top Layer w0.254: R1.1 14.06,5.72 8.64,5.72 5.06,9.29 DC11.1
  Bottom Layer w0.762: DC11.1 3.05,13.06 3.05,29.34 3.97,30.26 3.97,42.16 4.73,42.92 DC1.1
+12V-1: length 52.7
  Top Layer w0.254: 24.62,11.05 24.62,8.91 28.07,5.46 35.49,5.46 36.45,4.5 R2.1
  Bottom Layer w0.762: 25.44,42.92 21.46,38.95 21.46,32.64 25.65,28.45 25.65,12.09 25.15,11.58 25.15,11.05 24.62,11.05
+12V-2: length 8.7
  Top Layer w0.254: v1(50.42,9.65) 50.9,9.17 R3.1
  Bottom Layer w0.254: v1(50.42,9.65) 50.36,9.65 48.96,11.05 DC33.1
+12V-3: length 61.9
  Top Layer w0.254: v1(66.17,46.48) 66.43,46.48 66.48,46.53
  Top Layer w0.508: R4.1 61.03,9.17 61.68,8.51 61.68,7.45 ; 61.68,7.45 USB44.2 ; 61.68,7.45 61.86,7.62 v2(65.91,7.62) 66.48,7.05 66.48,6.03 ; 66.48,47.94 66.48,46.53 62.24,46.53 61.68,47.09 USB4.11
  Bottom Layer w0.508: v2(65.91,7.62) 67.18,8.89 67.18,45.47 v1(66.17,46.48)
+12V-4: length 68.4
  Top Layer w0.254: R5.1 73.79,3.95 ; 81.12,6.77 80.01,7.87 77.72,7.87 73.8,3.95
  Top Layer w0.508: v1(81.92,44.7) 81.92,37.97 82.42,37.47 82.47,37.47 v1(82.47,29.72) ; USB5.2 85.92,47.27 85.52,46.86 v1(82.3,46.86) 81.53,46.86 81.12,47.28 USB5.11 ; USB55.2 81.12,7.08 81.92,7.87 v1(85.85,7.87) 85.85,6.9 85.92,6.84 USB55.11 ; v1(82.42,26.42) 87.88,20.95 87.88,9.91 v1(87.12,9.14)
  Bottom Layer w0.508: v1(82.47,29.72) 82.47,26.47 v1(82.42,26.42) ; v1(85.85,7.87) v1(87.12,9.14) ; v1(82.3,46.86) 81.92,46.48 v1(81.92,44.7)
GND: length 320.2
  Top Layer w0.254: Q3.3 57.42,42.18 58.29,43.05 RQ4.1 ; U8.2 86.29,15.58 U1.20 ; 80.32,46.74 USB5.12 ; 80.32,46.74 77.64,46.74 ; 80.32,46.74 80.95,46.1 86.08,46.1 86.72,46.74 ; C4.2 21.66,17.27 C5.2 20.25,19.75 21.97,21.46 RRST.2 23.07,22.53 77.14,22.53 87.88,33.27 87.88,45.57 86.72,46.74 ; C4.2 20.69,15.62 v1(20.32,15.62) ; C4.2 23.57,16.59 24.77,17.78 26.09,17.78 26.1,17.77 U6.3 ; Q4.2 63.64,41.24 RQ4.1 ; 5.88,48.92 7.4,50.44 25.44,50.44 ; 7.55,35.17 7.74,35.37 Q2.2 11.61,35.17 RQ2.1 16.6,35.17 ; 7.55,35.17 7.55,30.28 6.88,29.62 USB1.1 ; 7.55,35.17 RQ1.1 3.77,35.17 Q1.2 ; RQ4.1 63.64,44.64 ; 86.72,46.74 USB5.1 ; 25.44,50.44 43.48,50.44 45,48.92 49.28,44.64 60.88,44.64 ; 25.44,50.44 25.44,48.92 29.59,44.77 RQ3.0.1 27.43,37.49 Q3.1.3 25.8,36.96 21.18,36.96 Q3.0.3 19.39,35.17 16.64,35.17 ; 16.6,35.17 16.61,35.18 16.64,35.17 ; 16.6,35.17 16.64,35.17 ; USB4.1 67.28,46.74 ; 67.28,46.74 77.64,46.74 ; 67.28,46.74 67.28,46.07 65.85,44.64 63.64,44.64 ; 77.64,46.74 77.59,46.69 RQ5.1 77.59,41.37 Q5.2 79.14,39.34 77.98,38.17 77.98,37.49 79.88,35.58 v1(79.88,35.56) ; 63.64,44.64 60.88,44.64 ; 60.88,44.64 60.88,47.94 ; 6.5,23.22 USB1.12 7.68,21.59 13.08,21.59 13.97,20.7 C6.1 C7.1
  Bottom Layer w0.254: v1(20.32,15.62) 14.48,15.62 C7.1 ; v1(79.88,35.56) 79.88,21.85 81.29,20.44 82.49,20.44 82.49,14.78 U8.2
VCC: length 170
  Top Layer w0.254: U7.1 66.42,15.37 82.55,15.37 83.01,15.82 U8.3 ; v1(18.41,21.21) 18.41,17.22 19.05,16.59 ; 19.05,16.59 C4.1 ; 19.05,16.59 19.05,15.36 20.02,14.4 30.43,14.4 U6.5 ; v1(64.52,24.13) 60.89,27.76 U1.31 62.02,35.68 70.92,35.68 POWER0.1 POWER0.4 ; RESET0.2 15.95,26.21 v1(18.41,23.75) 18.46,23.8 31.29,23.8 35.43,27.94 35.43,31.95 U1.40 38.03,38.81 36.07,40.77 32.61,40.77 RQ3VCC.2 ; v1(38.35,30.73) 51.05,30.73 v1(51.18,30.61)
  Bottom Layer w0.254: U7.1 64.11,13.94 64.64,14.47 64.64,24 v1(64.52,24.13) ; POWER0.4 81.73,41.87 LEDPWR0.1 ; v1(38.35,30.73) 38.28,30.81 38.28,34.29 U1.40 ; v1(18.41,21.21) v1(18.41,23.75) ; v1(51.18,30.61) 56.95,30.61 U1.31
VCCIN: length 80.3
  Top Layer w0.254: POWER0.5 POWER0.2 70.61,36.7 69.98,36.07 57.86,36.07 56.9,35.11 56.9,33.27 55.37,31.75 v1(37.59,31.75) ; USB1.11 6.5,24.02 7.11,24.63 7.11,25.65 8,26.54 8,28.07 v1(7.24,28.83) 7.23,28.82 USB1.2 ; v1(11.68,31.12) 12.32,31.75 v1(34.42,31.75)
  Bottom Layer w0.254: v1(11.68,31.12) 9.53,31.12 v1(7.24,28.83) ; v1(37.59,31.75) v1(34.42,31.75)
C00: length 45.5
  Top Layer w0.254: v1(2.81,33.49) 3.55,33.49 Q1.1 5.67,33.47 RQ1.2 ; RQ1.2 6.73,32.8 v1(6.73,32.26) ; RQ1.2 5.87,34.02 v1(6.02,34.17) ; v1(10.69,31.86) 11.26,32.43 v1(24.74,32.43)
  Bottom Layer w0.254: v1(10.69,31.86) 7.13,31.86 v1(6.73,32.26) ; U1.1 38.03,24.2 29.8,32.43 v1(24.74,32.43)
C01: length 37.3
  Top Layer w0.254: v1(30.48,33.02) 14.23,33.02 RQ2.2 11.61,33.66 Q2.1
  Bottom Layer w0.254: v1(30.48,33.02) 38.38,25.12 38.38,21.49 U1.2
C02: length 66.8
  Top Layer w0.254: v1(35.05,38.1) 35.01,38.15 RQ3.2 RQ3VCC.1 RQ3.0.2 29.59,36.96 31.21,35.33 32.01,35.33 30.46,33.78 26.16,33.78 24.61,35.33 ; U1.3 42.42,19.3 40.51,21.21 v2(39.75,21.21) ; v1(39.62,38.1) 58.42,38.1 59.96,39.64 Q3.1
  Top Layer w0.305: 24.13,35.33 24.61,35.33
  Bottom Layer w0.254: v2(39.75,21.21) 39.11,21.85 39.11,37.58 v1(39.62,38.1) v1(35.05,38.1)
C03: length 37.3
  Top Layer w0.254: U1.4 46.36,19.3 48.39,21.34 v2(53.21,21.34) ; RQ4.2 65.14,41.92 66.17,40.89 66.17,38.43 65.65,37.91 Q4.1 63.31,37.91 v1(62.36,36.96)
  Bottom Layer w0.254: v1(62.36,36.96) 62.23,36.83 62.23,34.04 57.79,29.59 57.79,25.91 v2(53.21,21.34)
C04: length 49.4
  Top Layer w0.254: 79.14,37.99 80.39,39.24 80.39,41.76 RQ5.2 ; 79.14,37.99 Q5.1 ; 79.14,37.99 79.88,37.25 v1(79.88,36.58) ; U1.5 49.46,20.57 v2(54.48,20.57) ; v1(61.72,29.59) 71.76,29.59 v1(74.93,32.77)
  Bottom Layer w0.254: v1(74.93,32.77) 74.93,35.43 76.07,36.58 v1(79.88,36.58) ; v1(61.72,29.59) 61.72,27.81 v2(54.48,20.57)
D+: length 32.3
  Top Layer w0.254: v1(4.57,26.42) 4.52,26.42 ; v1(4.57,26.42) 4.82,26.67 USB1.6 ; v1(4.57,26.42) 5.32,25.67 USB1.8 ; v1(4.57,26.42) 3.81,25.65 3.81,21.81 4.66,20.95 v1(11.3,20.95) ; v1(24.51,20.32) 27.15,20.32 U6.1
  Bottom Layer w0.254: v1(11.3,20.95) 17.02,20.95 17.65,20.32 v1(24.51,20.32)
D-: length 32.1
  Top Layer w0.254: USB1.5 7.35,27.17 v1(7.37,27.18) 7.37,26.67 6.86,26.17 USB1.7 ; U6.2 28.22,19.04 28.24,19.05 v1(29.08,19.05) ; v1(24.38,24.64) v1(26.54,24.64)
  Bottom Layer w0.254: v1(24.38,24.64) 18.67,24.64 18.29,25.02 9.53,25.02 v1(7.37,27.18) ; v1(29.08,19.05) 29.08,22.1 v1(26.54,24.64)
IRIN: length 26.1
  Top Layer w0.254: v1(79.25,10.92) 79.43,10.74 U8.1 ; v1(66.04,16.26) 78.74,16.26 v1(78.87,16.13)
  Bottom Layer w0.254: v1(79.25,10.92) 78.87,11.3 v1(78.87,16.13) ; v1(66.04,16.26) 66.04,19.23 U1.12
LED-PWR: length 10.4
  Top Layer w0.254: RPWR.2 85.62,43.79 87.38,42.04 87.38,35.63 U1.21
RST: length 63.1
  Top Layer w0.254: RESET0.3 10.76,22.23 19.64,22.23 RRST.1 22.06,23.11 v1(58.04,23.11) ; U7.2 60.2,14.48 v1(58.42,14.48)
  Bottom Layer w0.254: v1(58.42,14.48) 58.35,14.55 U1.9 58.8,19.76 58.8,22.35 v1(58.04,23.11)
RXD: length 29
  Top Layer w0.254: U1.10 59.35,17.77 U6.6
TC00: length 39.6
  Top Layer w0.254: DC11.2 8.24,1.87 LEDDEV1.2
  Top Layer w0.762: Q1.3 1.57,32.71 2.92,31.37 2.92,14.97 1.78,13.83 1.78,8.13 4.85,5.05 DC11.2
TC01: length 53.7
  Top Layer w0.254: 24.62,5.05 27.8,1.87 LEDDEV2.2 ; Q2.3 9.4,34.4 v1(8.23,34.4)
  Top Layer w0.762: 9.4,34.4 9.4,30.86 11.43,28.83 11.43,27.43 10.16,26.16 8.89,26.16 v1(7.87,25.15) ; v1(8.13,14.1) 11.81,10.41 11.81,8.89 15.65,5.05 24.62,5.05
  Bottom Layer w0.254: 7.87,24.64 8.13,24.38
  Bottom Layer w0.762: v1(8.13,14.1) 7.87,14.35 v1(7.87,25.15)
TC02: length 47.6
  Top Layer w0.254: LEDDEV3.2 47.36,1.87 DC33.2
  Top Layer w0.762: Q3.1.2 30.64,27.56 v2(33.27,27.56)
  Top Layer w2.54: Q3.0.2 Q3.1.2
  Bottom Layer w0.762: v2(33.27,27.56) 35.18,25.65 35.18,11.94 42.07,5.05 DC33.2
TC03: length 55.7
  Top Layer w0.254: 58,1.87 58.8,2.67 58.8,6.86 59.69,7.75 v1(60.07,7.75) ; v1(61.72,38.73) 61.85,38.86
  Top Layer w0.508: 56.8,1.87 LEDDEV4.2 58,1.87 ; v1(66.04,8.89) 67.28,7.65 USB44.12 ; v1(60.07,7.75) 60.88,6.94 60.88,6.03 ; 61.85,38.86 Q4.3
  Bottom Layer w0.508: 60.07,8.73 60.23,8.89 v1(66.04,8.89) ; 60.07,8.73 v1(60.07,7.75) ; 60.07,8.73 60.07,11.18 59.31,11.94 59.31,15.62 62.1,18.42 62.1,27.05 63.12,28.07 63.12,32.13 64.64,33.66 64.64,35.69 61.72,38.61 v1(61.72,38.73)
TC04: length 50.3
  Top Layer w0.254: LEDDEV5.2 78.23,2.89 78.23,6.35 79.12,7.24 v1(79.5,7.24) ; USB55.12 86.72,8.26 86.21,8.76 v1(81.28,8.76)
  Top Layer w0.508: v1(79.5,7.24) 79.76,7.24 80.32,6.68 USB55.1 ; v1(78.74,25.91) 77.34,27.31 77.34,38.66 Q5.3
  Bottom Layer w0.254: v1(81.28,8.76) 81.03,8.76
  Bottom Layer w0.508: 80.01,12.95 81.28,11.68 v1(81.28,8.76) ; v1(78.74,25.91) 78.74,21.72 79.96,20.5 79.96,12.95 ; 81.03,8.76 v1(79.5,7.24)
TXD: length 33.4
  Top Layer w0.254: U1.11 60.56,22.17 36.65,22.17 33.51,19.04 U6.7
XTAL1: length 80.4
  Top Layer w0.254: v1(33.4,14.86) 53.33,14.86 55.23,16.76 58.85,16.76 60.25,18.16 v1(74.8,18.16) 74.85,18.11 82.56,18.11 U1.19 ; v1(27.05,15.37) 22.48,15.37 v1(22.1,14.99)
  Bottom Layer w0.254: v1(74.8,18.16) 74.8,13.86 U2.2 ; v1(22.1,14.99) 12.83,14.99 11.68,16.13 C7.2 ; v1(33.4,14.86) 32.89,15.37 v1(27.05,15.37)
XTAL2: length 85.5
  Top Layer w0.254: v1(81.68,13.24) 80.75,14.17 71.79,14.17 U2.1 69.18,11.56 55.24,11.56 52.96,13.84 11.43,13.84 9.91,15.37 9.91,17.65 C6.2
  Bottom Layer w0.254: U1.18 81.21,13.71 v1(81.68,13.24)
$1N2137: length 12.2
  Top Layer w0.254: C5.1 21.84,18.67 24.32,21.14 31.69,21.14 U6.8
$1N11558: length 4.6
  Top Layer w0.254: RPWR.1 84.02,43.23 86.09,41.17 LEDPWR0.2
$1N11682: length 5.2
  Top Layer w0.254: LEDDEV1.1 12.39,3.01 15.16,3.01 R1.2
$1N30605: length 26.6
  Top Layer w0.254: v1(39.5,39.62) 40.13,38.99 58,38.99 58.69,39.68 Q3.2 ; RQ3.1 35.02,39.65 v1(35.05,39.62)
  Bottom Layer w0.254: v1(39.5,39.62) v1(35.05,39.62)
$1N32454: length 6.4
  Top Layer w0.254: LEDDEV2.1 32.04,2.79 35.66,2.79 R2.2
$1N32490: length 5
  Top Layer w0.254: LEDDEV3.1 51.21,3.97 ; 51.21,3.97 51.44,3.97 ; 51.21,3.97 52.07,4.83 R3.2
$1N32526: length 4.3
  Top Layer w0.254: 56.16,7.62 R4.2 56.11,5.52 LEDDEV4.1
$1N32562: length 6.1
  Top Layer w0.254: R5.2 72.56,3.13 76.38,3.13 LEDDEV5.1

## Copper pours and planes (outline as drawn; the poured copper is in the pictures)
+12V-2 on Bottom Layer: 40.39,44.07 51.82,44.07 51.82,9.65 40.39,9.65
GND on Top Layer: -2.41,57.28 91.57,57.28 91.57,-4.57 -2.41,-4.57

Small or netless copper shapes (teardrops, artwork), in the pictures only: 233 on Top Layer, 66 on Bottom Layer

## Text on the board
Bottom Silkscreen Layer: P10 | P11 | P12 | P13 | P14 | GND | +12V-0 | +12V-1 | VCC | +12V-2 | P00 | P01 | P30 | P31 | P21 | P20 | By Megre / 2023.11.15 V3
Top Silkscreen Layer: RST | VCC | VCCIN | DC12V1A | DC12V[6A] | GND | IRIN
